# EAGLE design SensorNodeUsb (EAGLE 9.4.2)
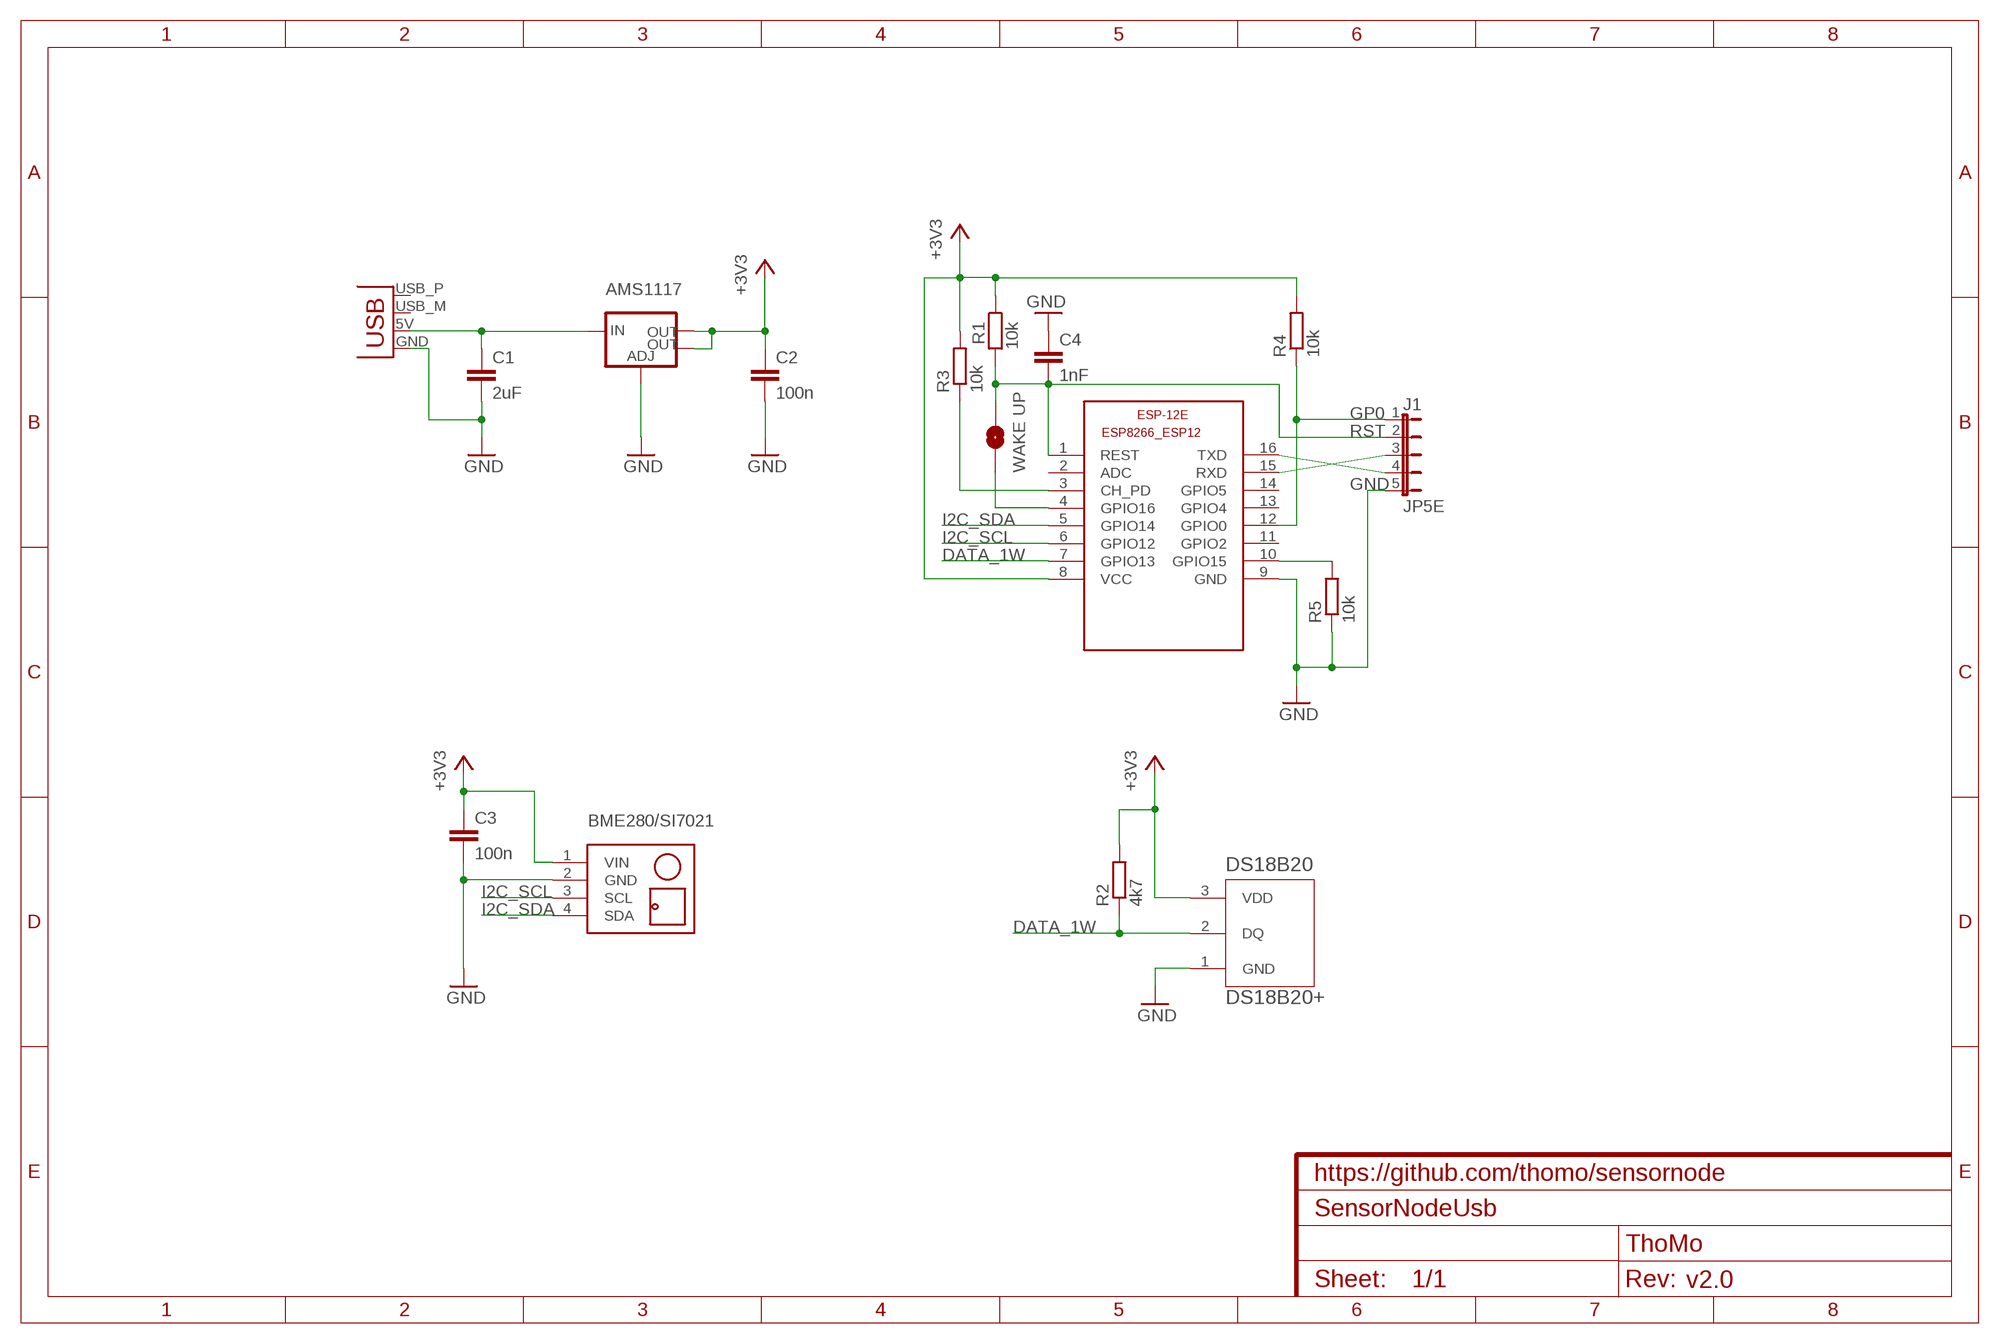
[diagram p0: schematic, sheet 1]
FRAME2 (FRAME-A4L): CNAME: https://github.com/thomo/sensornode; CREVISION: v2.0; DESIGNER: ThoMo

## Parts
AMS1117  V_REG_LM1117SOT223  [SOT223]
BME280/SI7021  TEMP-HUM-PRES-BME280  [TEMP-HUM-PRES-BME280]
C1  2uF  C-EUC1206  [C1206]
C2  100n  C-EUC1206  [C1206]
C3  100n  C-EUC1206K  [C1206K]
C4  1nF  C-EUC1206  [C1206]
DS18B20  DS18B20+  [TO-92]
ESP-12E  ESP8266-12  [ESP8266-ESP12]
J1  JP5E  [JP5]
R1  10k  R-EU_M1206  [M1206]
R2  4k7  R-EU_M1206  [M1206]
R3  10k  R-EU_M1206  [M1206]
R4  10k  R-EU_M1206  [M1206]
R5  10k  R-EU_M1206  [M1206]
WAKEUP  WAKE UP  JUMPER-SMT_2_NO_SILK  [SMT-JUMPER_2_NO_SILK]
X2  USBPCB  [USB-A-PCB]

## Nets
+3V3: AMS1117.2(OUT) AMS1117.4(OUT) BME280/SI7021.1(VIN) C2.1 C3.1 DS18B20.3(VDD) ESP-12E.8(VCC) R1.1 R2.2 R3.2 R4.2
DATA_1W: DS18B20.2(DQ) ESP-12E.7(GPIO13) R2.1
GND: AMS1117.1(ADJ) BME280/SI7021.2(GND) C1.2 C2.2 C3.2 C4.1 DS18B20.1(GND) ESP-12E.9(GND) J1.5 R5.1 X2.GND
GP0: ESP-12E.12(GPIO0) J1.1 R4.1
I2C_SCL: BME280/SI7021.3(SCL) ESP-12E.6(GPIO12)
I2C_SDA: BME280/SI7021.4(SDA) ESP-12E.5(GPIO14)
N$1: ESP-12E.15(RXD) J1.3
N$2: ESP-12E.4(GPIO16) WAKEUP.1
N$3: ESP-12E.3(CH_PD) R3.1
N$4: ESP-12E.16(TXD) J1.4
N$8: AMS1117.3(IN) C1.1 X2.5V(VBUS)
N$9: ESP-12E.10(GPIO15) R5.2
RST: C4.2 ESP-12E.1(REST) J1.2 R1.2 WAKEUP.2
Unconnected: ESP-12E.2(ADC) ESP-12E.11(GPIO2) ESP-12E.13(GPIO4) ESP-12E.14(GPIO5) X2.USB_M(D-) X2.USB_P(D+)

## Library data of the parts
AMS1117 = SparkFun-IC-Power:V_REG_LM1117: Voltage Regulator LM1117 Standard adjustable voltage regulator but in SMD form. Spark Fun Electronics SKU : COM-00595; PROD_ID: VREG-08170
BME280/SI7021 = thomo:TEMP-HUM-PRES-BME280: Digital Humidity-Temperature-Pressure Sensor based on BME280 device More information about BME280 device is available here: https://www.bosch-sensortec.com/bst/products/all_products/bme280 Click here to find device on ebay.com <http://www.ebay.com/sch/bme280+breakout>
C1-C4 = rcl:C-EU: CAPACITOR, European symbol; SPICEPREFIX: C
DS18B20 = thomo:DS18B20+: 1wire Temp Sensor; MANUFACTURER_PART_NUMBER: DS18B20+; VENDOR: Maxim Integrated Products
ESP-12E = ESP8266-ESP12E:ESP8266-12: ESP8266-12
J1 = thomo:JP5E: 5pin connector
R1-R5 = rcl:R-EU_: RESISTOR, European symbol; SPICEPREFIX: R
WAKEUP = SparkFun-Jumpers:JUMPER-SMT_2_NO: Normally open jumper This jumper has two pads in close proximity to each other. Apply solder to close the connection. Round pads are easier to solder for beginners, but are a lot larger. SparkFun Product that uses the round pads: SparkFun EL Sequencer <https://www.sparkfun.com/products/12781>
X2 = usb:USB: USB Connectors USB-B-PTH is fully proven SKU : PRT-00139 USB-miniB is fully proven SKU : PRT-00587 USB-A-PCB is untested. USB-A-H is throughly reviewed, but untested. Spark Fun Electronics SKU : PRT-00437 USB-B-SMT is throughly reviewed, but untested. Needs silkscreen touching up. USB-A-S has not been used/tested USB-MB-H has not been used/tested

## Board
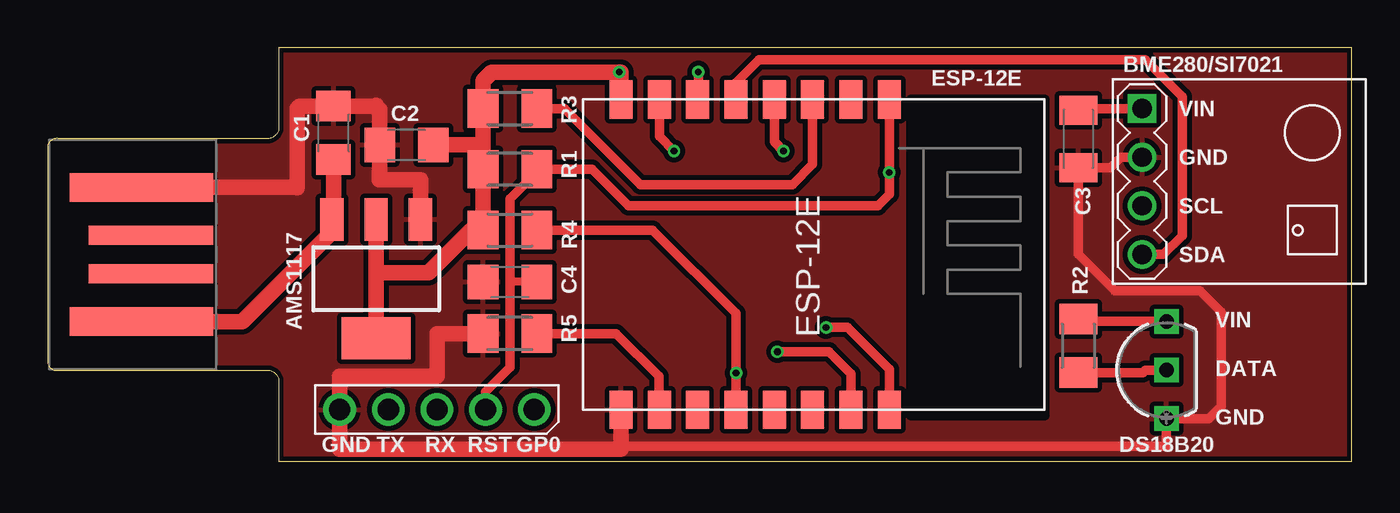
[diagram p1: board, top side]
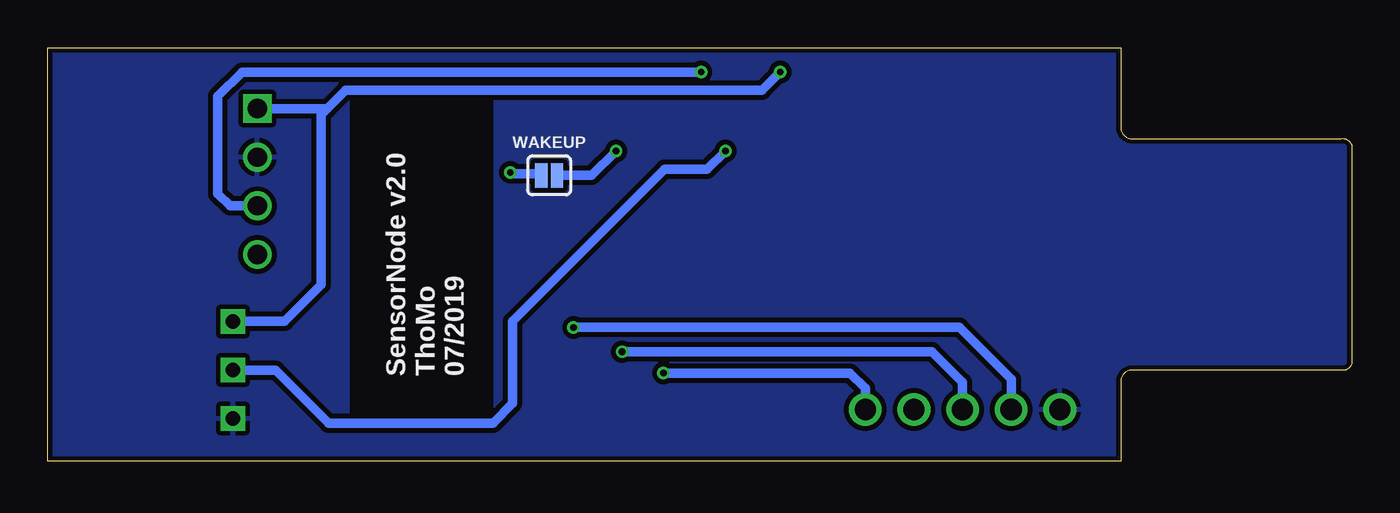
[diagram p2: board, bottom side, seen from below]

Size 68.09 x 21.58 mm. Coordinates in mm from the lower left corner, seen from the top.
Outline: 68.09,0 68.09,21.58 12.06,21.58 12.06,17.46 arc-90 11.43,16.83 0.64,16.83 arc90 0,16.51 0,5.08 arc90 0.64,4.76 11.43,4.76 arc-90 12.06,4.13 12.06,0 68.09,0
Copper layers (1*16): Top 0.035mm / dielectric 1.5mm / Bottom 0.035mm
Design rules "aisler_2_layer": minimum track width 0.1mm, minimum drill 0.2mm, track to track 0.1mm, track to pad 0.1mm, pad to pad 0.1mm, via to via 0.1mm, smd to smd 0.1mm, copper to edge 0.2mm, drill to drill 0.21mm, minimum pad ring 0.25mm, minimum via ring 0.15mm, stop-mask expansion 0mil, vias tented up to drill 0mil, thermal gap 10mil

### Footprints (pad centres in the part's own frame; a part is rotated, then mirrored left to right if it is on the bottom)
SOT223 = smd 1.219 x 2.235: 1 -2.311,-3.099; 2 0,-3.099; 3 2.311,-3.099 | smd 3.6 x 2.2: 4 0,3.099
TEMP-HUM-PRES-BME280 = drill 1 square: 1 -5.08,3.81 | drill 1: 2 -5.08,1.27; 3 -5.08,-1.27; 4 -5.08,-3.81
C1206 = smd 1.6 x 1.8: 1 -1.4,0; 2 1.4,0
C1206K = smd 1.5 x 2: 1 -1.5,0; 2 1.5,0
TO-92 = drill 0.762 pad 1.27 square: 1 -5.08,0; 2 -2.54,0; 3 0,0
ESP8266-ESP12 = smd 2 x 1.2: 1 -7.62,5.84; 2 -7.62,3.84; 3 -7.62,1.84; 4 -7.62,-0.16; 5 -7.62,-2.16; 6 -7.62,-4.16; 7 -7.62,-6.16; 8 -7.62,-8.16; 9 8.58,-8.16; 10 8.58,-6.16; 11 8.58,-4.16; 12 8.58,-2.16; 13 8.58,-0.16; 14 8.58,1.84; 15 8.58,3.84; 16 8.58,5.84
JP5 = drill 1.105 pad 1.705: 1 0,0; 2 2.54,0; 3 5.08,0; 4 7.62,0; 5 10.16,0
M1206 = smd 1.6 x 2: 1 -1.4,0; 2 1.4,0
SMT-JUMPER_2_NO_SILK = smd 0.635 x 1.27: 1 -0.406,0; 2 0.406,0
USB-A-PCB = smd 7.5 x 1.5: 5V -0.2,-3.5; GND -0.2,3.5 | smd 6.5 x 1: USB_M 0.3,-1; USB_P 0.3,1

### Placement (x,y rotation side)
AMS1117  17.14,9.53 180 top
BME280/SI7021  62.23,14.61 0 top
C1  14.92,17.14 90 top
C2  18.73,16.51 180 top
C3  53.82,16.83 270 top
C4  24.13,9.37 0 top
DS18B20  58.42,7.3 90 top
ESP-12E  38.1,11.27 270 top
J1  25.4,2.7 180 top
R1  24.13,15.24 0 top
R2  53.82,6.03 90 top
R3  24.13,18.41 180 top
R4  24.13,12.06 180 top
R5  24.13,6.67 0 top
WAKEUP  41.91,14.92 180 bottom
X2  5.08,10.79 0 top

### Tracks (layer width: path | path; a pad name or v marks a point on that pad's centre or on a via)
+3V3  (via drill 0.35)
  Top 0.406: R2.2 53.95,7.3 | v29.84,20.32 29.84,18.99 ESP-12E.8
  Top 0.508: C3.1 53.9,18.41 BME280/SI7021.1 | DS18B20.3 53.95,7.3
  Top 0.813: AMS1117.2 17.14,9.84 | 17.14,9.84 AMS1117.4 | 22.73,16.51 R1.1 R4.2 22.09,12.06 19.87,9.84 17.14,9.84 | 22.73,16.51 R3.2 22.73,19.87 23.18,20.32 29.94,20.32 ESP-12E.8 | C2.1 22.73,16.51
  Bottom 0.508: 53.5,18.41 53.82,18.1 53.82,9.21 55.72,7.3 DS18B20.3 | 53.5,18.41 52.55,19.37 30.8,19.37 v29.84,20.32 | 53.5,18.41 BME280/SI7021.1
DATA_1W  (via drill 0.35)
  Top 0.508: ESP-12E.7 31.94,16.95 v32.7,16.19 | R2.1 57.18,4.63 57.31,4.76 DS18B20.2
  Bottom 0.508: v32.7,16.19 33.66,15.24 35.88,15.24 43.81,7.3 43.81,3.02 44.84,1.99 53.42,1.99 56.2,4.76 DS18B20.2
GND
  Top 0.508: BME280/SI7021.2 56.04,15.88 55.49,15.33 C3.2 53.82,10.79 55.72,8.89 60.17,8.89 61.28,7.78 61.28,2.86 60.64,2.22 DS18B20.1 58.42,0.79 58.41,0.79 29.94,0.79
  Top 0.813: X2.GND 13.01,14.29 13.02,14.29 13.02,18.41 13.15,18.54 C1.2 17.12,18.54 17.14,18.57 17.33,18.39 C2.2 17.33,15.11 17.3,15.08 17.3,14.68 19.46,14.68 AMS1117.1 | R5.1 20.32,6.67 20.32,4.45 15.24,4.45 J1.5 15.24,0.64 29.94,0.64 ESP-12E.9 29.94,0.79
  pour Top (isolate 0.254): 12.06,21.59 12.06,16.83 8.89,16.83 8.89,4.76 12.06,4.76 12.06,0 68.1,0 68.1,21.59
  pour Bottom (isolate 0.254): 12.06,21.59 12.06,16.83 0,16.83 0,4.76 12.06,4.76 12.06,0 68.1,0 68.1,21.59
GP0  (via drill 0.35)
  Top 0.508: R4.1 31.59,12.06 35.94,7.72 v35.94,4.6 ESP-12E.12
  Bottom 0.508: J1.1 25.4,3.81 26.19,4.6 v35.94,4.6
I2C_SCL  (via drill 0.35)
  Top 0.406: 33.97,18.92 ESP-12E.6
  Top 0.508: v33.97,20.32 33.97,18.92
  Bottom 0.508: v33.97,20.32 57.94,20.32 59.21,19.05 59.21,13.97 58.58,13.34 BME280/SI7021.3
I2C_SDA
  Top 0.406: 35.94,19.75 ESP-12E.5
  Top 0.508: 35.94,19.75 37.15,20.95 57.31,20.95 59.24,19.02 59.24,11.78 58.26,10.79 BME280/SI7021.4
N$1  (via drill 0.35)
  Top 0.508: v38.1,5.71 40.8,5.71 41.94,4.57 ESP-12E.15
  Bottom 0.508: J1.3 20.32,4.13 21.91,5.71 v38.1,5.71
N$2  (via drill 0.35)
  Top 0.508: v38.42,16.19 37.94,16.67 ESP-12E.4
  Bottom 0.508: WAKEUP.1 39.69,14.92 v38.42,16.19
N$3
  Top 0.508: R3.1 26.99,18.41 30.96,14.45 38.89,14.45 39.94,15.49 ESP-12E.3
N$4  (via drill 0.35)
  Top 0.508: v40.64,6.99 41.75,6.99 43.94,4.8 ESP-12E.16
  Bottom 0.508: J1.4 17.78,4.29 20.48,6.99 v40.64,6.99
N$8
  Top 0.813: C1.1 14.92,12.71 AMS1117.3 14.83,11.98 10.15,7.29 X2.5V
N$9
  Top 0.406: ESP-12E.10 31.91,2.72
  Top 0.508: 31.91,2.72 31.91,4.45 29.69,6.67 R5.2
RST  (via drill 0.35)
  Top 0.406: C4.2 24.15,9.37
  Top 0.508: J1.2 22.86,3.62 24.15,4.91 24.15,9.37 24.15,13.71 25.53,15.09 R1.2 28.42,15.24 30.32,13.34 43.34,13.34 43.94,13.94 v43.94,15.08 ESP-12E.1
  Bottom 0.406: WAKEUP.2 42.41,15.01 | 43.87,15.01 v43.94,15.08
  Bottom 0.508: 42.41,15.01 43.87,15.01

### Text on the board
tNames: VIN | DATA | GND | GND | TX | RX | RST | GP0
bNames: SensorNode v2.0 / ThoMo / 07/2019